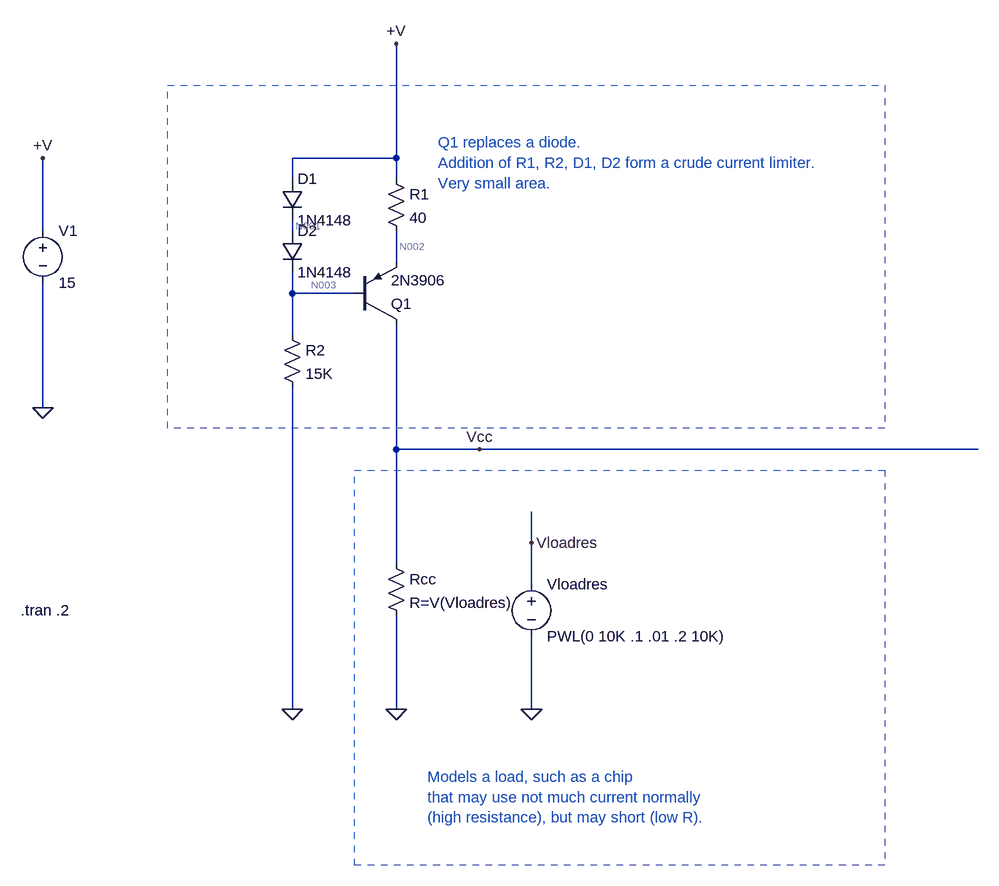
[diagram p0: schematic PosSupplyLimit.asc]
PosSupplyLimit.asc, the LTspice schematic file:
Version 4
SHEET 1 1076 1028
WIRE 176 -64 176 -240
WIRE 176 -64 16 -64
WIRE 16 -32 16 -64
WIRE 176 -32 176 -64
WIRE -368 48 -368 -64
WIRE 16 48 16 32
WIRE 176 96 176 48
WIRE 16 144 16 112
WIRE 112 144 16 144
WIRE 16 208 16 144
WIRE -368 320 -368 128
WIRE 176 384 176 192
WIRE 304 384 176 384
WIRE 1072 384 304 384
WIRE 384 528 384 480
WIRE 176 560 176 384
WIRE 384 592 384 528
WIRE 16 784 16 288
WIRE 176 784 176 640
WIRE 384 784 384 672
FLAG -368 320 0
FLAG -368 -64 +V
FLAG 176 -240 +V
FLAG 16 784 0
FLAG 176 784 0
FLAG 384 784 0
FLAG 384 528 Vloadres
FLAG 304 384 Vcc
SYMBOL pnp 112 192 M180
SYMATTR InstName Q1
SYMATTR Value 2N3906
SYMBOL res 160 -48 R0
SYMATTR InstName R1
SYMATTR Value 40
SYMBOL voltage -368 32 R0
WINDOW 123 0 0 Left 2
WINDOW 39 0 0 Left 2
SYMATTR InstName V1
SYMATTR Value 15
SYMBOL diode 0 -32 R0
SYMATTR InstName D1
SYMATTR Value 1N4148
SYMBOL res 0 192 R0
SYMATTR InstName R2
SYMATTR Value 15K
SYMBOL diode 0 48 R0
SYMATTR InstName D2
SYMATTR Value 1N4148
SYMBOL res 160 544 R0
SYMATTR InstName Rcc
SYMATTR Value R=V(Vloadres)
SYMBOL voltage 384 576 R0
WINDOW 123 0 0 Left 2
WINDOW 39 0 0 Left 2
SYMATTR InstName Vloadres
SYMATTR Value PWL(0 10K .1 .01 .2 10K)
TEXT -402 632 Left 2 !.tran .2
TEXT 240 -88 Left 2 ;Q1 replaces a diode.\nAddition of R1, R2, D1, D2 form a crude current limiter.\nVery small area.
TEXT 224 888 Left 2 ;Models a load, such as a chip\nthat may use not much current normally \n(high resistance), but may short (low R).
RECTANGLE Normal 928 352 -176 -176 2
RECTANGLE Normal 928 1024 112 416 2

The netlist it stands for:
* PosSupplyLimit.asc
Q1 Vcc N003 N002 0 2N3906
R1 +V N002 40
V1 +V 0 15
D1 +V N001 1N4148
R2 N003 0 15K
D2 N001 N003 1N4148
Rcc Vcc 0 R=V(Vloadres)
Vloadres Vloadres 0 PWL(0 10K .1 .01 .2 10K)
.model D D
.lib standard.dio
.model NPN NPN
.model PNP PNP
.lib standard.bjt
.tran .2
* Q1 replaces a diode.
* Addition of R1, R2, D1, D2 form a crude current limiter.
* Very small area.
* Models a load, such as a chip
* that may use not much current normally
* (high resistance), but may short (low R).
.backanno
.end

* Results of the author's LTspice run, read from the files saved beside the schematic
* Operating Point, zero values left out:
*   V(vcc) = 14.89 V
*   V(n003) = 14.18 V
*   V(n002) = 14.9 V
*   V(+v) = 15 V
*   V(n001) = 14.59 V
*   V(vloadres) = 10 kV
*   I(Rcc) = 1.489 mA
*   Ic(Q1) = -1.489 mA
*   Ib(Q1) = -924.9 µA
*   Ie(Q1) = 2.414 mA
*   I(D2) = 20.67 µA
*   I(D1) = 20.67 µA
*   I(R2) = 945.5 µA
*   I(R1) = 2.414 mA
*   I(V1) = -2.435 mA
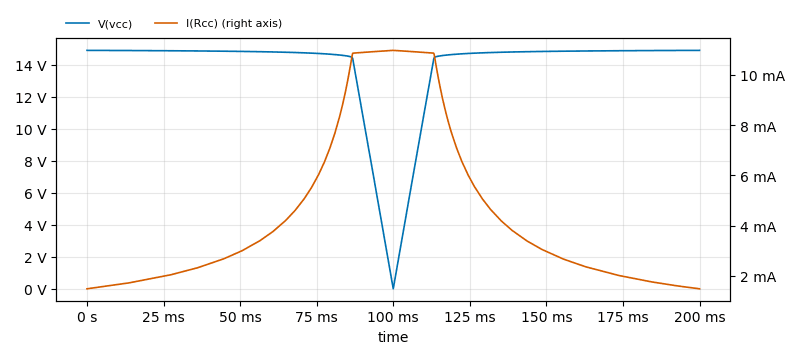
[diagram p1: Transient Analysis of PosSupplyLimit.asc, plotted from the saved traces]
* Transient Analysis, 1 run:
*   V(vcc): min 109.7 µV, max 14.89 V, average 13.8 V, rms 14.16 V, last 14.89 V
*   I(Rcc): min 1.489 mA, max 10.97 mA, average 4.432 mA, rms 5.473 mA, last 1.489 mA